# Altium schematic sheet 高边开关模块.SchDoc: 高边开关模块
size A3; Author: GAOYANG; Organization: Altium Limited; Address1: L3, 12a Rodborough Rd; Address2: Frenchs Forest; Address3: NSW; Address4: Australia 2086
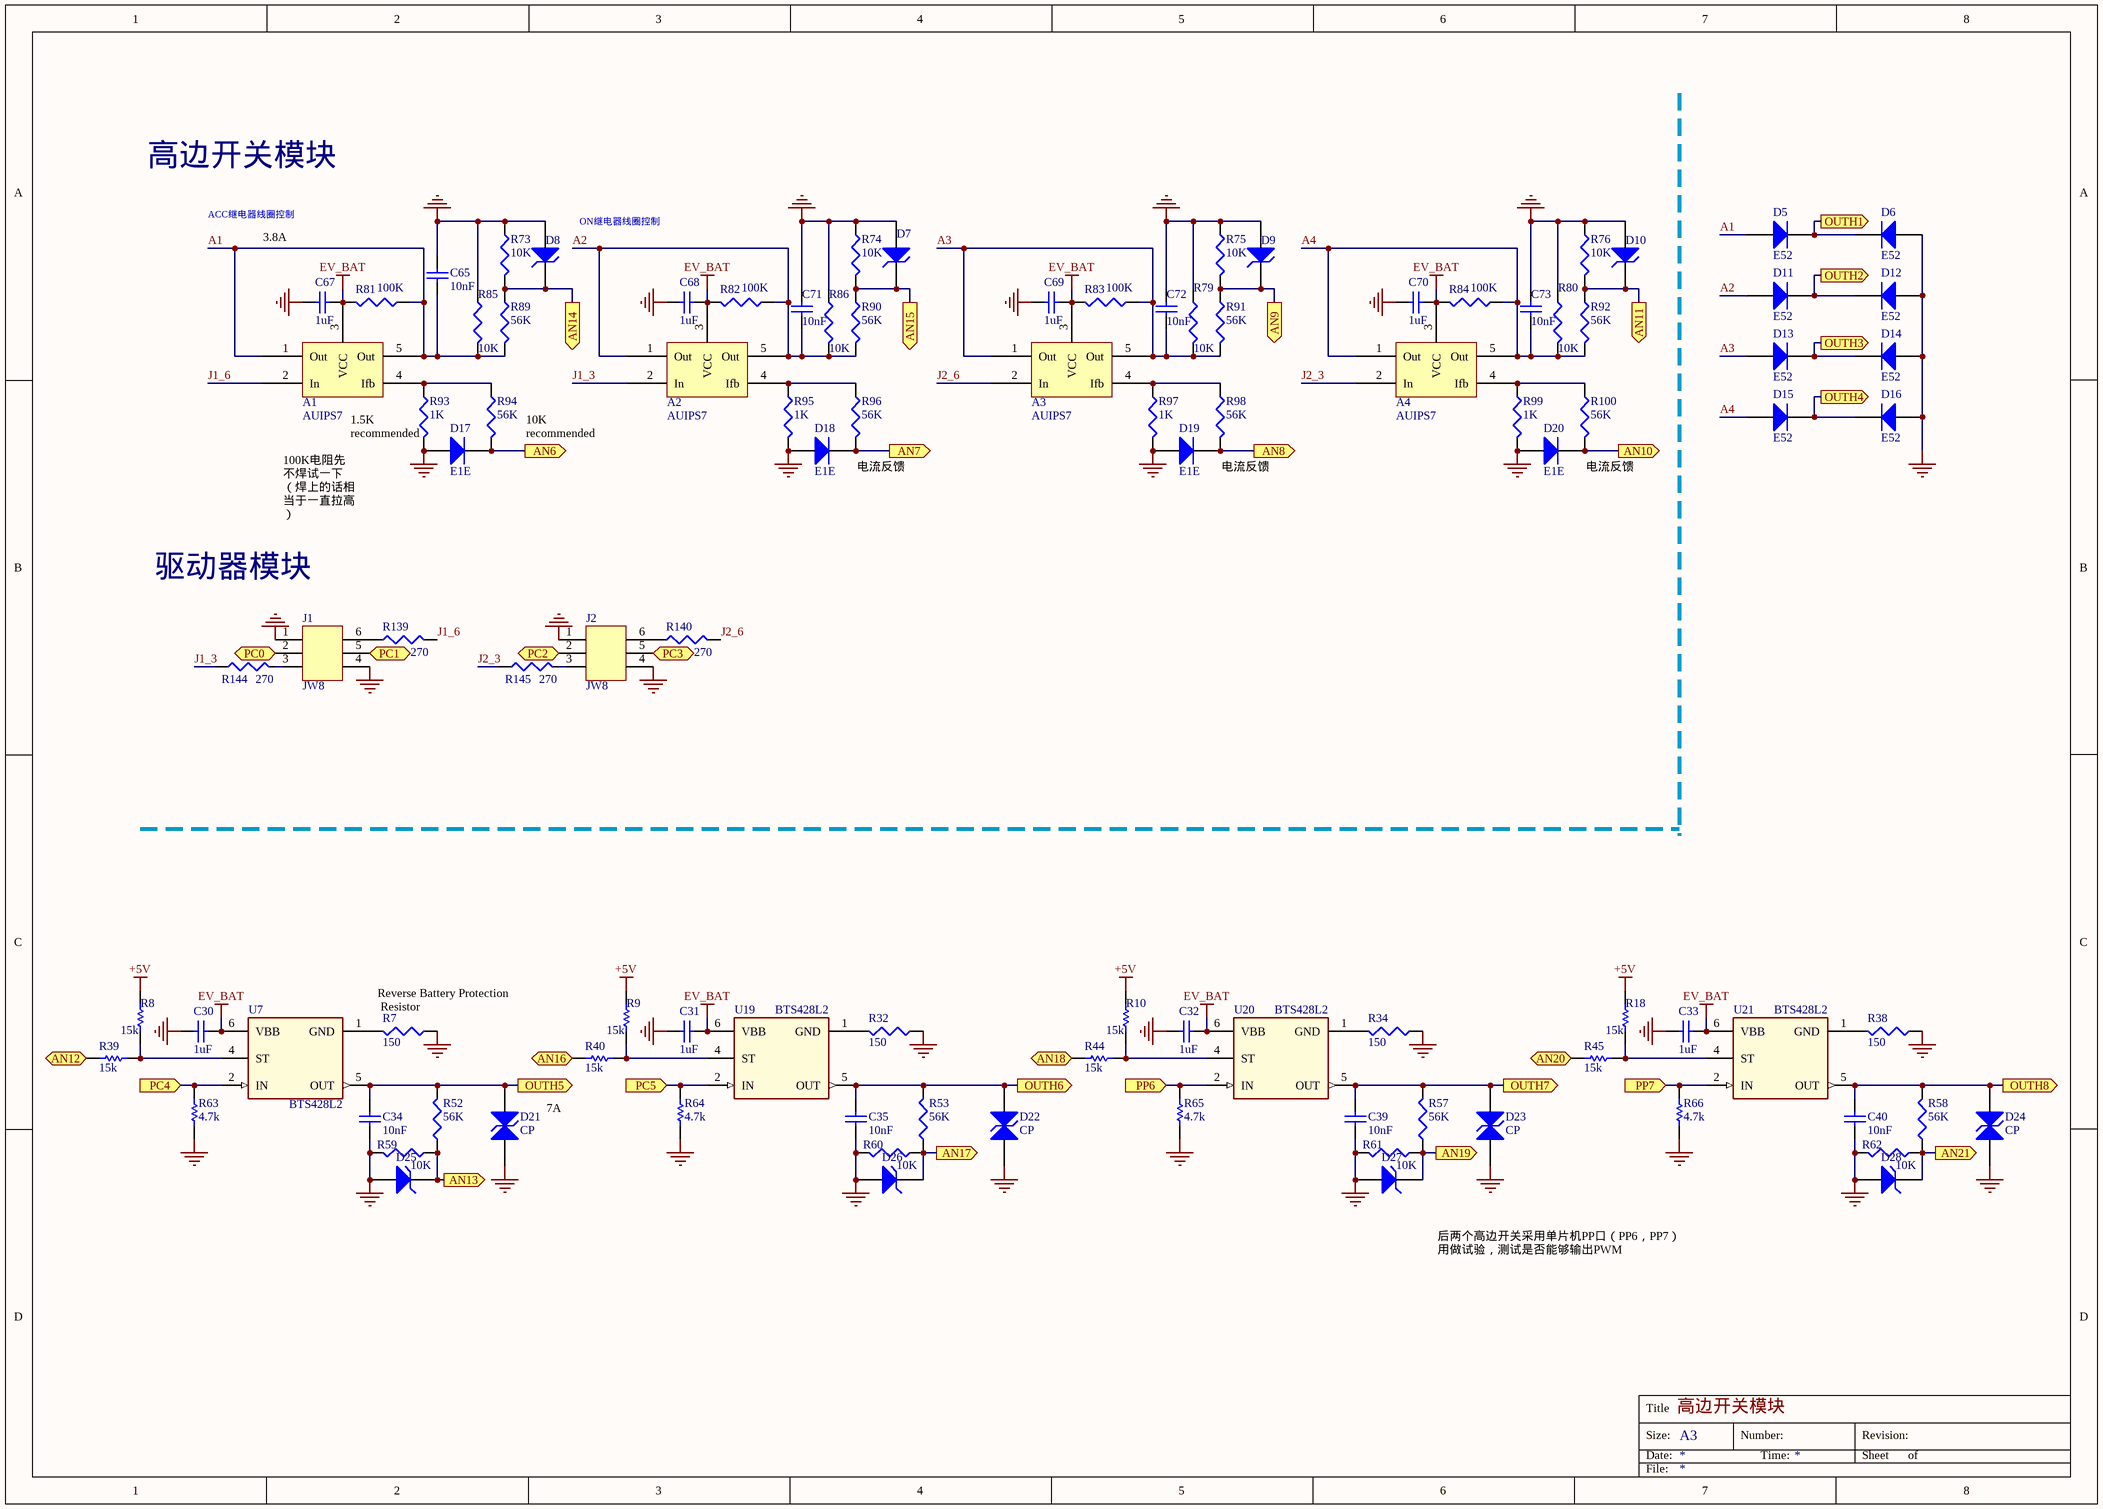
[diagram p0: 高边开关模块.SchDoc]

## Parts
A1  AUIPS7  [AUIPS7]
A2  AUIPS7  [AUIPS7]
A3  AUIPS7  [AUIPS7]
A4  AUIPS7  [AUIPS7]
C30  value 1uF  [0603-L]  (hidden comment: Cap)
C31  value 1uF  [0603-L]  (hidden comment: Cap)
C32  value 1uF  [0603-L]  (hidden comment: Cap)
C33  value 1uF  [0603-L]  (hidden comment: Cap)
C34  value 10nF  [0603-L]  (hidden comment: Cap)
C35  value 10nF  [0603-L]  (hidden comment: Cap)
C39  value 10nF  [0603-L]  (hidden comment: Cap)
C40  value 10nF  [0603-L]  (hidden comment: Cap)
C65  value 10nF  [0603-L]  (hidden comment: Cap)
C67  value 1uF  [0603-L]  (hidden comment: Cap)
C68  value 1uF  [0603-L]  (hidden comment: Cap)
C69  value 1uF  [0603-L]  (hidden comment: Cap)
C70  value 1uF  [0603-L]  (hidden comment: Cap)
C71  value 10nF  [0603-L]  (hidden comment: Cap)
C72  value 10nF  [0603-L]  (hidden comment: Cap)
C73  value 10nF  [0603-L]  (hidden comment: Cap)
D5  E52  [E52]
D6  E52  [E52]
D7  D Zener  [0805]  (value not drawn)
D8  D Zener  [0805]  (value not drawn)
D9  D Zener  [0805]  (value not drawn)
D10  D Zener  [0805]  (value not drawn)
D11  E52  [E52]
D12  E52  [E52]
D13  E52  [E52]
D14  E52  [E52]
D15  E52  [E52]
D16  E52  [E52]
D17  E1E  [E1E]
D18  E1E  [E1E]
D19  E1E  [E1E]
D20  E1E  [E1E]
D21  CP  [E52]
D22  CP  [E52]
D23  CP  [E52]
D24  CP  [E52]
D25  D Zener  [0805]  (value not drawn)
D26  D Zener  [0805]  (value not drawn)
D27  D Zener  [0805]  (value not drawn)
D28  D Zener  [0805]  (value not drawn)
J1  JW8  [JW8]
J2  JW8  [JW8]
R7  value 150  [RES1206]  (hidden comment: Res3)
R8  value 15k  [0603-Resistor]  (hidden comment: RT0603BRD0710KL)
R9  value 15k  [0603-Resistor]  (hidden comment: RT0603BRD0710KL)
R10  value 15k  [0603-Resistor]  (hidden comment: RT0603BRD0710KL)
R18  value 15k  [0603-Resistor]  (hidden comment: RT0603BRD0710KL)
R32  value 150  [RES1206]  (hidden comment: Res3)
R34  value 150  [RES1206]  (hidden comment: Res3)
R38  value 150  [RES1206]  (hidden comment: Res3)
R39  value 15k  [0603-Resistor]  (hidden comment: RT0603BRD0710KL)
R40  value 15k  [0603-Resistor]  (hidden comment: RT0603BRD0710KL)
R44  value 15k  [0603-Resistor]  (hidden comment: RT0603BRD0710KL)
R45  value 15k  [0603-Resistor]  (hidden comment: RT0603BRD0710KL)
R52  value 56K  [0603-L]  (hidden comment: Res3)
R53  value 56K  [0603-L]  (hidden comment: Res3)
R57  value 56K  [0603-L]  (hidden comment: Res3)
R58  value 56K  [0603-L]  (hidden comment: Res3)
R59  value 10K  [0603-L]  (hidden comment: Res3)
R60  value 10K  [0603-L]  (hidden comment: Res3)
R61  value 10K  [0603-L]  (hidden comment: Res3)
R62  value 10K  [0603-L]  (hidden comment: Res3)
R63  value 4.7k  [0603-Resistor]  (hidden comment: RC0603FR-074K7L)
R64  value 4.7k  [0603-Resistor]  (hidden comment: RC0603FR-074K7L)
R65  value 4.7k  [0603-Resistor]  (hidden comment: RC0603FR-074K7L)
R66  value 4.7k  [0603-Resistor]  (hidden comment: RC0603FR-074K7L)
R73  value 10K  [0603-L]  (hidden comment: Res3)
R74  value 10K  [0603-L]  (hidden comment: Res3)
R75  value 10K  [0603-L]  (hidden comment: Res3)
R76  value 10K  [0603-L]  (hidden comment: Res3)
R79  value 10K  [0603-L]  (hidden comment: Res3)
R80  value 10K  [0603-L]  (hidden comment: Res3)
R81  value 100K  [0603-L]  (hidden comment: Res3)
R82  value 100K  [0603-L]  (hidden comment: Res3)
R83  value 100K  [0603-L]  (hidden comment: Res3)
R84  value 100K  [0603-L]  (hidden comment: Res3)
R85  value 10K  [0603-L]  (hidden comment: Res3)
R86  value 10K  [0603-L]  (hidden comment: Res3)
R89  value 56K  [0603-L]  (hidden comment: Res3)
R90  value 56K  [0603-L]  (hidden comment: Res3)
R91  value 56K  [0603-L]  (hidden comment: Res3)
R92  value 56K  [0603-L]  (hidden comment: Res3)
R93  value 1K  [RES1206]  (hidden comment: Res3)
R94  value 56K  [0603-L]  (hidden comment: Res3)
R95  value 1K  [RES1206]  (hidden comment: Res3)
R96  value 56K  [0603-L]  (hidden comment: Res3)
R97  value 1K  [RES1206]  (hidden comment: Res3)
R98  value 56K  [0603-L]  (hidden comment: Res3)
R99  value 1K  [RES1206]  (hidden comment: Res3)
R100  value 56K  [0603-L]  (hidden comment: Res3)
R139  value 270  [RES0805]  (hidden comment: Res3)
R140  value 270  [RES0805]  (hidden comment: Res3)
R144  value 270  [RES0805]  (hidden comment: Res3)
R145  value 270  [RES0805]  (hidden comment: Res3)
U7  BTS428L2  [TO114P998X235-6_5N-V]
U19  BTS428L2  [TO114P998X235-6_5N-V]
U20  BTS428L2  [TO114P998X235-6_5N-V]
U21  BTS428L2  [TO114P998X235-6_5N-V]

## Ports
AN6 (out), AN7 (out), AN8 (out), AN9 (out), AN10 (out), AN11 (out), AN12 (out), AN13 (out), AN14 (out), AN15 (out), AN16 (out), AN17 (out), AN18 (out), AN19 (out), AN20 (out), AN21 (out), OUTH1 (out), OUTH2 (out), OUTH3 (out), OUTH4 (out), OUTH5 (out), OUTH6 (out), OUTH7 (out), OUTH8 (out), PC0 (in), PC1 (in), PC2 (in), PC3 (in), PC4 (in), PC5 (in), PP6 (in), PP7 (in)

## Nets
+5V: R8.2 R9.2 R10.2 R18.2
EV_BAT: A1.3(VCC) A2.3(VCC) A3.3(VCC) A4.3(VCC) C30.1 C31.1 C32.1 C33.1 C67.1 C68.1 C69.1 C70.1 R81.1 R82.1 R83.1 R84.1 U7.6(VBB) U19.6(VBB) U20.6(VBB) U21.6(VBB)
GND: C30.2 C31.2 C32.2 C33.2 C34.2 C35.2 C39.2 C40.2 C65.1 C67.2 C68.2 C69.2 C70.2 C71.1 C72.1 C73.1 D6.1(A) D7.1(A) D8.1(A) D9.1(A) D10.1(A) D12.1(A) D14.1(A) D16.1(A) D17.1(A) D18.1(A) D19.1(A) D20.1(A) D21.2(A2) D22.2(A2) D23.2(A2) D24.2(A2) D25.1(A) D26.1(A) D27.1(A) D28.1(A) J1.1 J1.4 J2.1 J2.4 R7.1 R32.1 R34.1 R38.1 R59.1 R60.1 R61.1 R62.1 R63.1 R64.1 R65.1 R66.1 R73.2 R74.2 R75.2 R76.2 R79.2 R80.2 R85.2 R86.2 R93.1 R95.1 R97.1 R99.1
A1: A1.1(Out) A1.5(Out) C65.2 D5.1(A) R81.2 R85.1 R89.1
A2: A2.1(Out) A2.5(Out) C71.2 D11.1(A) R82.2 R86.1 R90.1
A3: A3.1(Out) A3.5(Out) C72.2 D13.1(A) R79.1 R83.2 R91.1
A4: A4.1(Out) A4.5(Out) C73.2 D15.1(A) R80.1 R84.2 R92.1
AN6: D17.2(K) R94.1 ; port AN6
AN7: D18.2(K) R96.1 ; port AN7
AN8: D19.2(K) R98.1 ; port AN8
AN9: D9.2(K) R75.1 R91.2 ; port AN9
AN10: D20.2(K) R100.1 ; port AN10
AN11: D10.2(K) R76.1 R92.2 ; port AN11
AN12: R39.1 ; port AN12
AN13: D25.2(K) R52.2 R59.2 ; port AN13
AN14: D8.2(K) R73.1 R89.2 ; port AN14
AN15: D7.2(K) R74.1 R90.2 ; port AN15
AN16: R40.1 ; port AN16
AN17: D26.2(K) R53.2 R60.2 ; port AN17
AN18: R44.1 ; port AN18
AN19: D27.2(K) R57.2 R61.2 ; port AN19
AN20: R45.1 ; port AN20
AN21: D28.2(K) R58.2 R62.2 ; port AN21
J1_3: A2.2(In) R144.1
J1_6: A1.2(In) R139.1
J2_3: A4.2(In) R145.1
J2_6: A3.2(In) R140.1
OUTH1: D5.2(K) D6.2(K) ; port OUTH1
OUTH2: D11.2(K) D12.2(K) ; port OUTH2
OUTH3: D13.2(K) D14.2(K) ; port OUTH3
OUTH4: D15.2(K) D16.2(K) ; port OUTH4
OUTH5: C34.1 D21.1(A1) R52.1 U7.5(OUT) ; port OUTH5
OUTH6: C35.1 D22.1(A1) R53.1 U19.5(OUT) ; port OUTH6
OUTH7: C39.1 D23.1(A1) R57.1 U20.5(OUT) ; port OUTH7
OUTH8: C40.1 D24.1(A1) R58.1 U21.5(OUT) ; port OUTH8
PC0: J1.2 ; port PC0
PC1: J1.5 ; port PC1
PC2: J2.2 ; port PC2
PC3: J2.5 ; port PC3
PC4: R63.2 U7.2(IN) ; port PC4
PC5: R64.2 U19.2(IN) ; port PC5
PP6: R65.2 U20.2(IN) ; port PP6
PP7: R66.2 U21.2(IN) ; port PP7
NetA1_4: A1.4(Ifb) R93.2 R94.2
NetA2_4: A2.4(Ifb) R95.2 R96.2
NetA3_4: A3.4(Ifb) R97.2 R98.2
NetA4_4: A4.4(Ifb) R99.2 R100.2
NetJ1_3: J1.3 R144.2
NetJ1_6: J1.6 R139.2
NetJ2_3: J2.3 R145.2
NetJ2_6: J2.6 R140.2
NetR7_2: R7.2 U7.1(GND)
NetR8_1: R8.1 R39.2 U7.4(ST)
NetR9_1: R9.1 R40.2 U19.4(ST)
NetR10_1: R10.1 R44.2 U20.4(ST)
NetR18_1: R18.1 R45.2 U21.4(ST)
NetR32_2: R32.2 U19.1(GND)
NetR34_2: R34.2 U20.1(GND)
NetR38_2: R38.2 U21.1(GND)

## Notes on the sheet
- 高边开关模块
- ACC继电器线圈控制
- 3.8A
- (near D8) ON继电器线圈控制
- (near R93) 1.5K
  recommended
- (near R94) 10K
  recommended
- 电流反馈
- 驱动器模块
- 100K电阻先不焊试一下
  （焊上的话相当于一直拉高）
- (near R7) Reverse Battery Protection
  Resistor
- 7A
- 后两个高边开关采用单片机PP口（PP6，PP7）
  用做试验，测试是否能够输出PWM
- Title
- Size:
- Date:
- A3
- Number:
- Time:
- Revision:
- Sheet
- of
- File:

## Library data of the parts
C30-C35 C39 C40 C65 C67-C73 = Cap: Capacitor; Published: 8-Jun-2000; LatestRevisionDate: 17-Jul-2002; LatestRevisionNote: Re-released for DXP Platform.; PackageReference: RAD-0.3; Publisher: Altium Limited; PackageDescription: Radial Cap, Thru-Hole; 2 Leads; 0.3 in Pin Spacing
D5 D6 D11-D20 = Diode: Default Diode; Published: 8-Jun-2000; LatestRevisionDate: 17-Jul-2002; LatestRevisionNote: Re-released for DXP Platform.; PackageVersion: Sep-1996; PackageReference: SMC; Publisher: Altium Limited; PackageDescription: DO-214-AB/SMC; 2 C-Bend Leads; Body 7.9 x 5.9 mm, inc. leads (LxW); Code_JEDEC: DO-214-AB
D7-D10 D25-D28 = D Zener: Zener Diode; Published: 8-Jun-2000; LatestRevisionDate: 17-Jul-2002; LatestRevisionNote: Re-released for DXP Platform.; PackageReference: DIODE-0.7; Publisher: Altium Limited; PackageDescription: Diode, Thru-Hole; 2 Leads; 0.7 in Pin Spacing
J1 J2 = JW8: inductive load driver
R7 R32 R34 R38 R52 R53 R57-R62 R73-R76 R79-R86 R89-R100 R139 R140 R144 R145 = Res3: Resistor; Published: 8-Jun-2000; LatestRevisionDate: 29-May-2009; LatestRevisionNote: IPC-7351 Footprint Added.; PackageReference: J1-0603; Publisher: Altium Limited; PackageDescription: Chip Resistor
R8-R10 R18 R39 R40 R44 R45 = RT0603BRD0710KL: RES, 10k ohm, 0.1%, 0.1W, 0603; Manufacturer: YAGEO; CompType: Resistor; Polarized: N; TempCo_ppm/C: 25; Tolerance_%: 0.1; U/M: EA; Vaule_DC: 75; Packaging Type: Paper taping reel; Value_Current: 1A; ComponentLink1URL: http://www.yageo.com/NewPortal/yageo?service=application&layer1=Consumer%20Electronics&lang=en#; Res_ohm: 15k; LatestRevisionDate: 2016-06-12; LatestRevisionNote: AddComment; MountType: SMT; PackageReference: 0603; PartNumber: RT0603BRD0710KL; Published: 2016-01-22; Publisher: YAGEO; RoHS: Y; Supplier 1: TL; Supplier Part Number: RT0603BRD0710KL; SymbolVerision: 2016-06-12; Technology: Thick Film; Value_Tolerance: 0.1%; Value_Power: 0.1W; Value_Code: 15k; Automotive: N; Rated Current: 1A; ComponentLink1Description: Component introduction
R63-R66 = RC0603FR-074K7L: RES, 4.7k ohm, 1%, 0.1W, 0603; Manufacturer: YAGEO; CompType: Resistor; Res_ohm: 0; Polarized: N; TempCo_ppm/C: 200; Tolerance_%: 1; U/M: EA; Value_Code: 4k7; Vaule_DC: 75; Packaging Type: Paper taping reel; Value_Current: 1A; ComponentLink1URL: http://www.yageo.com/NewPortal/yageo?service=application&layer1=Consumer%20Electronics&lang=en#; LatestRevisionDate: 2016-06-12; LatestRevisionNote: AddComment; MountType: SMT; PackageReference: 0603; PartNumber: RC0603FR-074K7L; Published: 2016-01-22; Publisher: YAGEO; RoHS: Y; Supplier 1: TL; Supplier Part Number: RC0603FR-074K7L; SymbolVerision: 2016-06-12; Technology: Thick Film; Value_Tolerance: 1%; Value_Power: 0.1W; Automotive: N; Rated Current: 1A; ComponentLink1Description: Component introduction
U7 U19-U21 = BTS428L2: Smart High-Side Power Switch, One Channel, 60mOhm, Status Feedback; Manufacturer: Infineon Technologies; ManufacturerPartNumber: BTS428L2; PackageReference: PG-TO252-5-11